# Altium schematic sheet HydroController2016.SchDoc
size A4
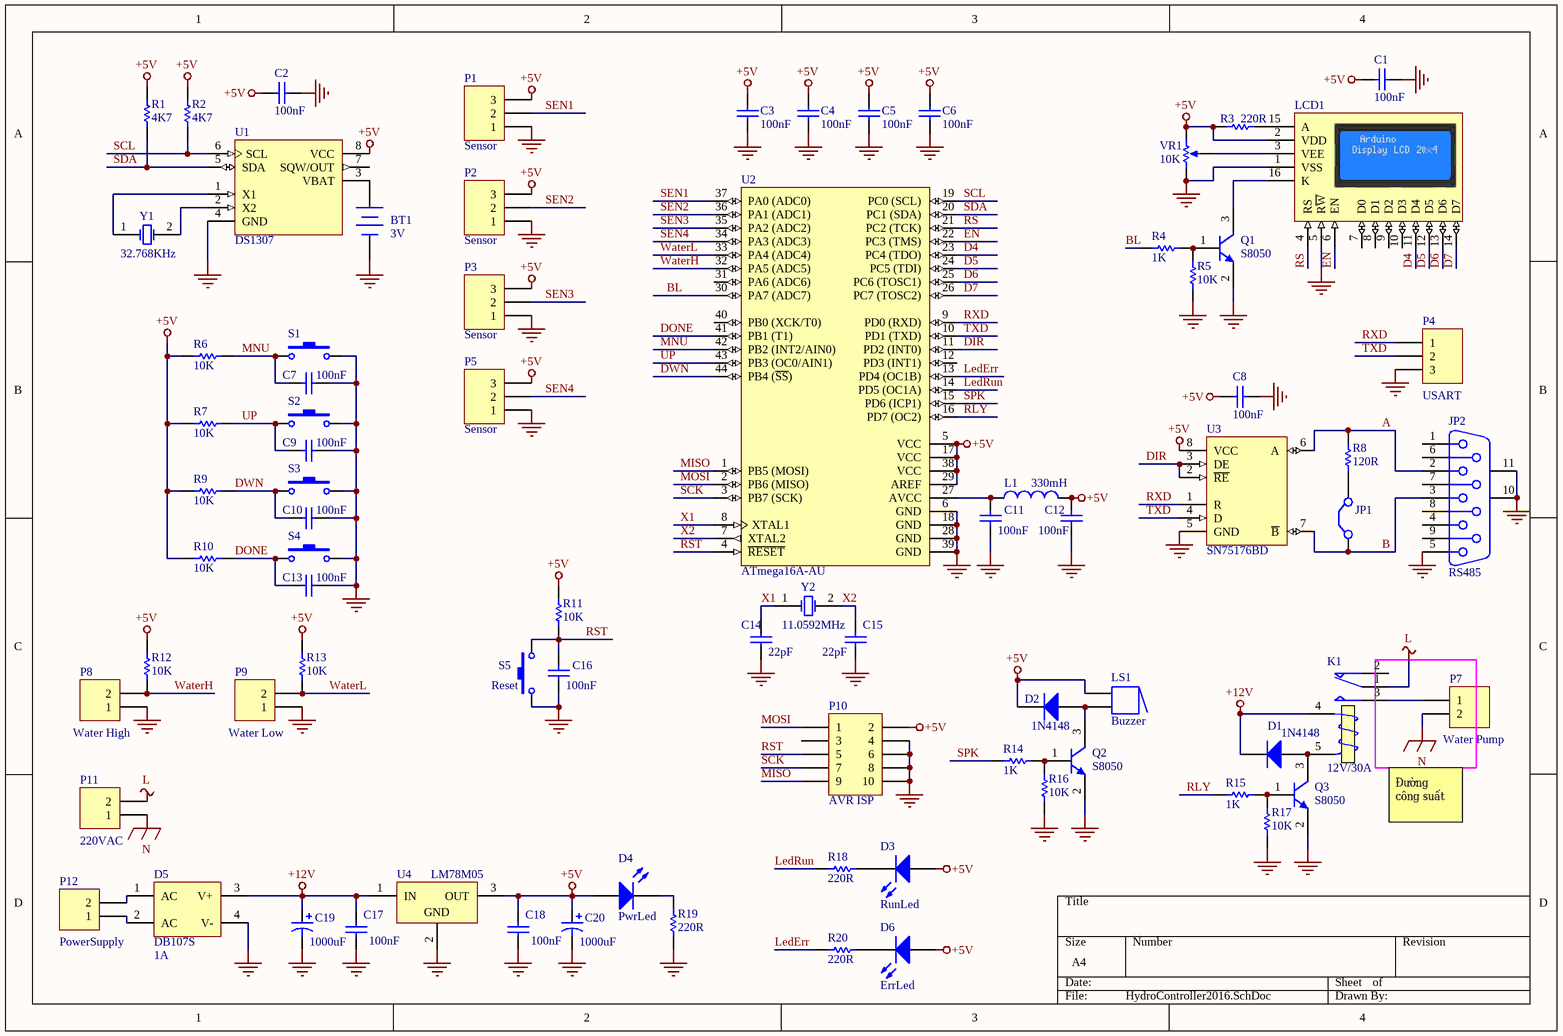
[diagram p0: HydroController2016.SchDoc]

## Parts
BT1  3V  [SK-BATT-CR1220]
C1  value 100nF  [C-0805]  (hidden comment: 104)
C2  value 100nF  [C-0805]  (hidden comment: 104)
C3  value 100nF  [C-0805]  (hidden comment: 104)
C4  value 100nF  [C-0805]  (hidden comment: 104)
C5  value 100nF  [C-0805]  (hidden comment: 104)
C6  value 100nF  [C-0805]  (hidden comment: 104)
C7  value 100nF  [C-0805]  (hidden comment: 104)
C8  value 100nF  [C-0805]  (hidden comment: 104)
C9  value 100nF  [C-0805]  (hidden comment: 104)
C10  value 100nF  [C-0805]  (hidden comment: 104)
C11  value 100nF  [C-0805]  (hidden comment: 104)
C12  value 100nF  [C-0805]  (hidden comment: 104)
C13  value 100nF  [C-0805]  (hidden comment: 104)
C14  value 22pF  [C-0805]  (hidden comment: 22)
C15  value 22pF  [C-0805]  (hidden comment: 22)
C16  value 100nF  [C-0805]  (hidden comment: 104)
C17  value 100nF  [C-0805]  (hidden comment: 104)
C18  value 100nF  [C-0805]  (hidden comment: 104)
C19  value 1000uF  [C-ALU-10x10mm]  (hidden comment: 1000uF/25V)
C20  value 1000uF  [C-ALU-10x10mm]  (hidden comment: 1000uF/25V)
D1  1N4148  [D-SOD-80]
D2  1N4148  [D-SOD-80]
D3  value RunLed  [LED-RECT-5x2mm]  (hidden comment: LED-2x5-BLU)
D4  value PwrLed  [LED-RECT-5x2mm]  (hidden comment: LED-2x5-RED)
D5  DB107S  value 1A  [D-DB-1A-SMD]
D6  value ErrLed  [LED-RECT-5x2mm]  (hidden comment: LED-2x5-RED)
JP1  Jumper  [JP2.54-M-2-A]  (value not drawn)
JP2  value RS485  [CONN-DSUB9-MS]  (hidden comment: D Connector 9)
K1  12V/30A  [RL-5P-12V30A]
L1  330mH  [L-0805]
LCD1  LCD2004  [LCD-2004]  (value not drawn)
LS1  Buzzer  [Buzzer]
P1  value Sensor  [CONN-XH2.54-3P]  (hidden comment: XH2.54-3P)
P2  value Sensor  [CONN-XH2.54-3P]  (hidden comment: XH2.54-3P)
P3  value Sensor  [CONN-XH2.54-3P]  (hidden comment: XH2.54-3P)
P4  value USART  [CONN-XH2.54-3P]  (hidden comment: XH2.54-3P)
P5  value Sensor  [CONN-XH2.54-3P]  (hidden comment: XH2.54-3P)
P7  value Water Pump  [TER-KF301-2]  (hidden comment: KF301-2P)
P8  value Water High  [CONN-XH2.54-2P]  (hidden comment: XH2.54-2P)
P9  value Water Low  [CONN-XH2.54-2P]  (hidden comment: XH2.54-2P)
P10  value AVR ISP  [CONN-IDC-5X2-A]  (hidden comment: IDC5x2)
P11  value 220VAC  [TER-KF301-2]  (hidden comment: KF301-2P)
P12  value PowerSupply  [TER-KF301-2]  (hidden comment: H2)
Q1  S8050  [SOT-23-3]
Q2  S8050  [SOT-23-3]
Q3  S8050  [SOT-23-3]
R1  4K7  [R-0805]
R2  4K7  [R-0805]
R3  220R  [R-0805]
R4  1K  [R-0805]
R5  10K  [R-0805]
R6  10K  [R-0805]
R7  10K  [R-0805]
R8  120R  [R-0805]
R9  10K  [R-0805]
R10  10K  [R-0805]
R11  10K  [R-0805]
R12  10K  [R-0805]
R13  10K  [R-0805]
R14  1K  [R-0805]
R15  1K  [R-0805]
R16  10K  [R-0805]
R17  10K  [R-0805]
R18  220R  [R-0805]
R19  220R  [R-0805]
R20  220R  [R-0805]
S1  SW-T-S12  [SW-T-S12]  (value not drawn)
S2  SW-T-S12  [SW-T-S12]  (value not drawn)
S3  SW-T-S12  [SW-T-S12]  (value not drawn)
S4  SW-T-S12  [SW-T-S12]  (value not drawn)
S5  value Reset  [SW-T-S6-SMD]  (hidden comment: SW-T-S6)
U1  DS1307  [SOIC-8]
U2  ATmega16A-AU  [TQFP-44]
U3  SN75176BD  [SOIC-8]
U4  value LM78M05  [TO-252-3]  (hidden comment: LM78M05CDTX)
VR1  10K  [VR-RM063]
Y1  32.768KHz  [XTAL-AB38T-SMD]
Y2  11.0592MHz  [XTAL-CSM7]

## Nets
+5V: C1.1 C2.2 C3.2 C4.2 C5.2 C6.2 C8.2 C12.2 C18.1 C20.1 D2.2(K) D3.1(A) D4.1(A) D6.1(A) L1.2 LCD1.2(VDD) LS1.1 P1.3 P2.3 P3.3 P5.3 P10.2 R1.2 R2.2 R3.1 R6.2 R7.2 R9.2 R10.2 R11.2 R12.2 R13.2 U1.8(VCC) U2.5(VCC) U2.17(VCC) U2.29(AREF) U2.38(VCC) U3.8(VCC) U4.3(OUT) VR1.3(BOT)
+12V: C17.1 C19.1 D1.2(K) D5.3(V+) K1.4(T1) U4.1(IN)
GND: BT1.2(-) C1.2 C2.1 C3.1 C4.1 C5.1 C6.1 C7.1 C8.1 C9.1 C10.1 C11.1 C12.1 C13.1 C14.1 C15.1 C16.1 C17.2 C18.2 C19.2 C20.2 D5.4(V-) JP2.5 JP2.10(MH1) JP2.11(MH2) LCD1.1(VSS) LCD1.5(R~{W}) P1.1 P2.1 P3.1 P4.3 P5.1 P8.1 P9.1 P10.4 P10.6 P10.8 P10.10 Q1.2(E) Q2.2(E) Q3.2(E) R5.1 R16.1 R17.1 R19.1 S1.2 S2.2 S3.2 S4.2 S5.1 U1.4(GND) U2.6(GND) U2.18(GND) U2.28(GND) U2.39(GND) U3.5(GND) U4.2(GND) VR1.1(TOP)
L: K1.1(COM) P11.2
N: P7.2 P11.1
A: JP2.2 R8.1 U3.6(A)
B: JP1.1(C1) JP2.3 U3.7(~{B})
BL: R4.2 U2.30(PA7_(ADC7))
D4: LCD1.11(D4) U2.23(PC4_(TDO))
D5: LCD1.12(D5) U2.24(PC5_(TDI))
D6: LCD1.13(D6) U2.25(PC6_(TOSC1))
D7: LCD1.14(D7) U2.26(PC7_(TOSC2))
DIR: U2.11(PD2_(INT0)) U3.2(~{RE}) U3.3(DE)
DONE: C13.2 R10.1 S4.1 U2.41(PB1_(T1))
DWN: C10.2 R9.1 S3.1 U2.44(PB4_(~{SS}))
EN: LCD1.6(EN) U2.22(PC3_(TMS))
LedErr: R20.1 U2.13(PD4_(OC1B))
LedRun: R18.1 U2.14(PD5_(OC1A))
MISO: P10.9 U2.1(PB5_(MOSI))
MNU: C7.2 R6.1 S1.1 U2.42(PB2_(INT2/AIN0))
MOSI: P10.1 U2.2(PB6_(MISO))
RLY: R15.2 U2.16(PD7_(OC2))
RS: LCD1.4(RS) U2.21(PC2_(TCK))
RST: C16.2 P10.5 R11.1 S5.2 U2.4(~{RESET})
RXD: P4.1 U2.9(PD0_(RXD)) U3.1(R)
SCK: P10.7 U2.3(PB7_(SCK))
SCL: R2.1 U1.6(SCL) U2.19(PC0_(SCL))
SDA: R1.1 U1.5(SDA) U2.20(PC1_(SDA))
SEN1: P1.2 U2.37(PA0_(ADC0))
SEN2: P2.2 U2.36(PA1_(ADC1))
SEN3: P3.2 U2.35(PA2_(ADC2))
SEN4: P5.2 U2.34(PA3_(ADC3))
SPK: R14.2 U2.15(PD6_(ICP1))
TXD: P4.2 U2.10(PD1_(TXD)) U3.4(D)
UP: C9.2 R7.1 S2.1 U2.43(PB3_(OC0/AIN1))
WaterH: P8.2 R12.1 U2.32(PA5_(ADC5))
WaterL: P9.2 R13.1 U2.33(PA4_(ADC4))
X1: C14.2 U2.8(XTAL1) Y2.1(OSC1)
X2: C15.2 U2.7(XTAL2) Y2.2(OSC2)
NetBT1_1: BT1.1(+) U1.3(VBAT)
NetC11_2: C11.2 L1.1 U2.27(AVCC)
NetD1_1: D1.1(A) K1.5(T2) Q3.3(C)
NetD2_1: D2.1(A) LS1.2 Q2.3(C)
NetD3_2: D3.2(K) R18.2
NetD4_2: D4.2(K) R19.2
NetD5_1: D5.1(AC) P12.2
NetD5_2: D5.2(AC) P12.1
NetD6_2: D6.2(K) R20.2
NetJP1_2: JP1.2(C2) R8.2
NetK1_3: K1.3(NO) P7.1
NetLCD1_3: LCD1.3(VEE) VR1.2(TAP)
NetLCD1_15: LCD1.15(A) R3.2
NetLCD1_16: LCD1.16(K) Q1.3(C)
NetQ1_1: Q1.1(B) R4.1 R5.2
NetQ2_1: Q2.1(B) R14.1 R16.2
NetQ3_1: Q3.1(B) R15.1 R17.2
NetU1_1: U1.1(X1) Y1.1(OSC1)
NetU1_2: U1.2(X2) Y1.2(OSC2)

Not connected (* = marked no-connect by the designer): JP2 1 4 6 7 8 9; K1 2(NC); LCD1 7(D0) 8(D1) 9(D2) 10(D3); P10 3; U1 7(SQW/OUT); U2 12(PD3_(INT1)) 31(PA6_(ADC6)) 40(PB0_(XCK/T0))

## Notes on the sheet
- (near K1) Đường công suất

## Library data of the parts
BT1 = Battery: Multicell Battery; Published: 24-Mar-1999; LatestRevisionDate: 17-Jul-2002; LatestRevisionNote: Re-released for DXP Platform.; PackageReference: BAT-2; Value: 3V; PackageDescription: Battery; 2 Leads
C1-C18 = Cap: Capacitor; Published: 8-Jun-2000; LatestRevisionDate: 17-Jul-2002; LatestRevisionNote: Re-released for DXP Platform.; PackageReference: RAD-0.3; Publisher: Altium Limited; PackageDescription: Radial Cap, Thru-Hole; 2 Leads; 0.3 in Pin Spacing
C19 C20 = Cap Pol1: Tụ Tantalum 107E-100uF 25V SMD7343; Published: 8-Jun-2000; LatestRevisionDate: 17-Jul-2002; LatestRevisionNote: Re-released for DXP Platform.; PackageReference: RB7.6-15; Publisher: Altium Limited; PackageDescription: Polarized Capacitor (Radial); 2 Leads
D1 D2 = Diode: Default Diode; Published: 8-Jun-2000; LatestRevisionDate: 17-Jul-2002; LatestRevisionNote: Re-released for DXP Platform.; PackageVersion: Sep-1996; PackageReference: SMC; Value: 1N4148; PackageDescription: DO-214-AB/SMC; 2 C-Bend Leads; Body 7.9 x 5.9 mm, inc. leads (LxW); Code_JEDEC: DO-214-AB
D3 D4 D6 = LED0: Typical INFRARED GaAs LED; Published: 8-Jun-2000; LatestRevisionDate: 08-Jul-2005; LatestRevisionNote: Mech Layer 1 removed.; PackageReference: LED-0; PackageDescription: LED; 2 Leads
D5 = Bridge2: Diode Bridge; Published: 24-Mar-1999; LatestRevisionDate: 17-Jul-2002; LatestRevisionNote: Re-released for DXP Platform.; PackageReference: D-46_6A; PackageDescription: Bridge Rectifier; 4 Terminals; Body 16.8 x 16.8 mm (typ); Pitch 10.67 mm
JP1 = Jumper: Jumper Wire
JP2 = D Connector 9: Receptacle Assembly, 9 Position, Right Angle; PackageDocument: O; Positions: 9; Link: http://banlinhkien.vn/goods-1787-dp9-cai-chan-thang-oc.html; LatestRevisionDate: 17-Jul-2002; LatestRevisionNote: Re-released for DXP Platform.; DatasheetDocument: 1-Sep-1999; PackageReference: 788750; Orientation: Right Angle; Gender: Receptacle
K1 = Relay: Single-Pole Dual-Throw Relay; Manufacturer: Songle; Manufacturer Part Number: SRD-12VDC-SL-C; Link: http://banlinhkien.vn/goods-1006-relay-12v-10a-5c-srd-12vdc-sl-c.html
L1 = Inductor: Code_IEC: 1005; Published: 8-Jun-2000; LatestRevisionDate: 29-May-2009; LatestRevisionNote: IPC-7351 Footprint Added.; PackageReference: 0402-A; Publisher: Altium Limited; PackageDescription: Chip Inductor; Code_JEITA: 0402; Value: 330mH
LCD1 = LCD2004: Liquid Crystal Display; Value: LCD2004
LS1 = Buzzer: Magnetic Transducer Buzzer; Published: 24-Mar-1999; LatestRevisionDate: 17-Dec-2003; LatestRevisionNote: Schematic revised, PCB Footprint replaced.; DatasheetVersion: 17-Dec-2003; PackageReference: ABSM-1574; Publisher: Altium Limited; PackageDescription: Magnetic Transducer Buzzer; ComponentLink1Description: Manufacturer Link; ComponentLink1URL: http://www.megastar.com/linecard/buzzmode/index.php
P1-P5 = Header 3: Header, 3-Pin; LatestRevisionDate: 17-Jul-2002; LatestRevisionNote: Re-released for DXP Platform.
P7-P9 P11 P12 = Header 2: Header, 2-Pin; LatestRevisionDate: 17-Jul-2002; LatestRevisionNote: Re-released for DXP Platform.
P10 = Header 5X2: Header, 5-Pin, Dual row; LatestRevisionDate: 17-Jul-2002; LatestRevisionNote: Re-released for DXP Platform.
Q1-Q3 = NPN: NPN Bipolar Transistor; Published: 8-Jun-2000; LatestRevisionDate: 17-Jul-2002; LatestRevisionNote: Re-released for DXP Platform.; PackageReference: TO-226-AA; Value: S8050; PackageDescription: TO, Flat Index; 3 In-Line, Axial Leads; Body Dia. 4.8mm; Leads 0.55 x 0.51 mm (max); Code_JEDEC: TO-226-AA
R1-R20 = Res1: Resistor; Published: 8-Jun-2000; LatestRevisionDate: 17-Jul-2002; LatestRevisionNote: Re-released for DXP Platform.; PackageReference: AXIAL-0.3; Publisher: Altium Limited; PackageDescription: Axial Device, Thru-Hole; 2 Leads; 0.3 in Pin Spacing
  R1 R2: Value: 4K7
  R3 R18-R20: Value: 220R
  R4 R14 R15: Value: 1K
  R5-R7 R9-R13 R16 R17: Value: 10K
  R8: Value: 120R
S1-S4 = SW-PB: Switch; Value: MNU; Published: 24-Mar-1999; LatestRevisionDate: 17-Jul-2002; LatestRevisionNote: Re-released for DXP Platform.; PackageReference: SPST-2; PackageDescription: Switch; 2 Leads
S5 = SW-PB: Switch; Published: 24-Mar-1999; LatestRevisionDate: 17-Jul-2002; LatestRevisionNote: Re-released for DXP Platform.; PackageReference: SPST-2; PackageDescription: Switch; 2 Leads
U1 = DS1307: 64 X 8 Serial Real-Time Clock; Published: 13-Oct-2000; LatestRevisionDate: 17-Jul-2002; LatestRevisionNote: Re-released for DXP Platform.; DatasheetVersion: 10-Aug-1999; PackageVersion: 1999; PackageReference: DIP8; Publisher: Altium Limited; PackageDescription: DIP, 8-Pin, Row Spacing 7.62 mm, Pitch 2.54 mm; ComponentLink1Description: Manufacturer Link; ComponentLink1URL: http://www.maxim-ic.com/; ComponentLink2Description: Datasheet; ComponentLink2URL: http://pdfserv.maxim-ic.com/en/ds/DS1307.pdf; ComponentLink3Description: Discontinuation Notice; ComponentLink3URL: http://www.maxim-ic.com/qa/pdfs/non-obsolescence-letter.pdf
U2 = ATmega16A-AU: 8-bit AVR Microcontroller, 16KB Flash, 512 Bytes EEPROM, 1KB SRAM, 44-pin TQFP, Industrial Grade (-40°C to 85°C); Published: 1-Apr-2010; DatasheetVersion: revB, Jul-2009; PackageVersion: rev.B, Oct-2001; PackageReference: 44A; Publisher: Altium Limited; PackageDescription: 44-Pin Plastic Thin Profile Quad Flat Pack, 10 x 10 x 1.0 mm Body, 0.8 mm Pitch (TQFP); Supplier 1: Digi-Key; Supplier Part Number 1: ATMEGA16A-AU-ND; Supplier 2: Farnell; Supplier Part Number 2: 1704560; Supplier 3: Mouser; Supplier Part Number 3: 556-ATMEGA16A-AU; ComponentLink1Description: Manufacturer Link; ComponentLink1URL: http://www.atmel.com/products/avr/default.asp?; ComponentLink2Description: ATmega16A Datasheet; ComponentLink2URL: http://www.atmel.com/dyn/resources/prod_documents/doc8154.pdf; ComponentLink3Description: ATmega16A Summary; ComponentLink3URL: http://www.atmel.com/dyn/resources/prod_documents/8154S.pdf; ComponentLink4Description: Atmel.com Home; ComponentLink4URL: http://www.atmel.com
U3 = SN75176BD: Differential Bus Transceiver; Note: Receiver Hysteresis of 50mV Typical; Published: 15-May-2002; LatestRevisionDate: 13-Apr-2006; LatestRevisionNote: IPC-7351 Footprint Added.; DatasheetVersion: Sep-1989; PackageVersion: Jan-1998; PackageReference: D008; Publisher: Altium Limited; PackageDescription: 8-Pin Small Outline Integrated Circuit 1.27 mm Pitch; Code_IPC: SOIC127P600-8; ComponentLink1Description: Manufacturer Link; ComponentLink1URL: http://www.ti.com/; ComponentLink2Description: Datasheet; ComponentLink2URL: http://www-s.ti.com/sc/ds/sn75176b.pdf
U4 = CMP-0062-00204-3: 3-Terminal Positive Voltage Regulators, 3-pin TO-252; Manufacturer: Texas Instruments; PackageTopMarking: NSUZXYTT*LM78M05*CDT; PowerWise: N; CompType: LDO IC; ComponentLink1Description: Datasheet URL; ComponentLink1URL: http://www.ti.com/general/docs/lit/getliterature.tsp?genericPartNumber=LM78M05&fileType=pdf; PackageReference: NDP0003B; Code_JEDEC: TO-252-AA; PinCount: 3; PackageDescription: TO252, Molded, Jedec, 6.8 x 6.10 x 2.30mm Body, 3 Lead, 2.28mm Pitch, Surface Mount
VR1 = RPot: Potentiometer; Sim Note: Enter the Resistance value and the set point into parameter fields.; Set Position: 0.5; Published: 8-Jun-2000; LatestRevisionDate: 17-Jul-2002; LatestRevisionNote: Re-released for DXP Platform.; PackageReference: VR5; Publisher: Altium Limited; Value: 10K
Y1 Y2 = XTAL: Crystal Oscillator; Published: 8-Jun-2000; LatestRevisionDate: 17-Jul-2002; LatestRevisionNote: Re-released for DXP Platform.; PackageReference: R38; PackageDescription: Crystal, Thru-Hole; 2 Leads; Body 3.1 x 8.2 mm (Dia.xH)
  Y1: Value: 32.768KHz
  Y2: Value: 11.0592MHz